# Altium schematic sheet BIT(Built in Test).SchDoc
size 297 x 209 mm; SheetNumber: 8; SheetTotal: 29
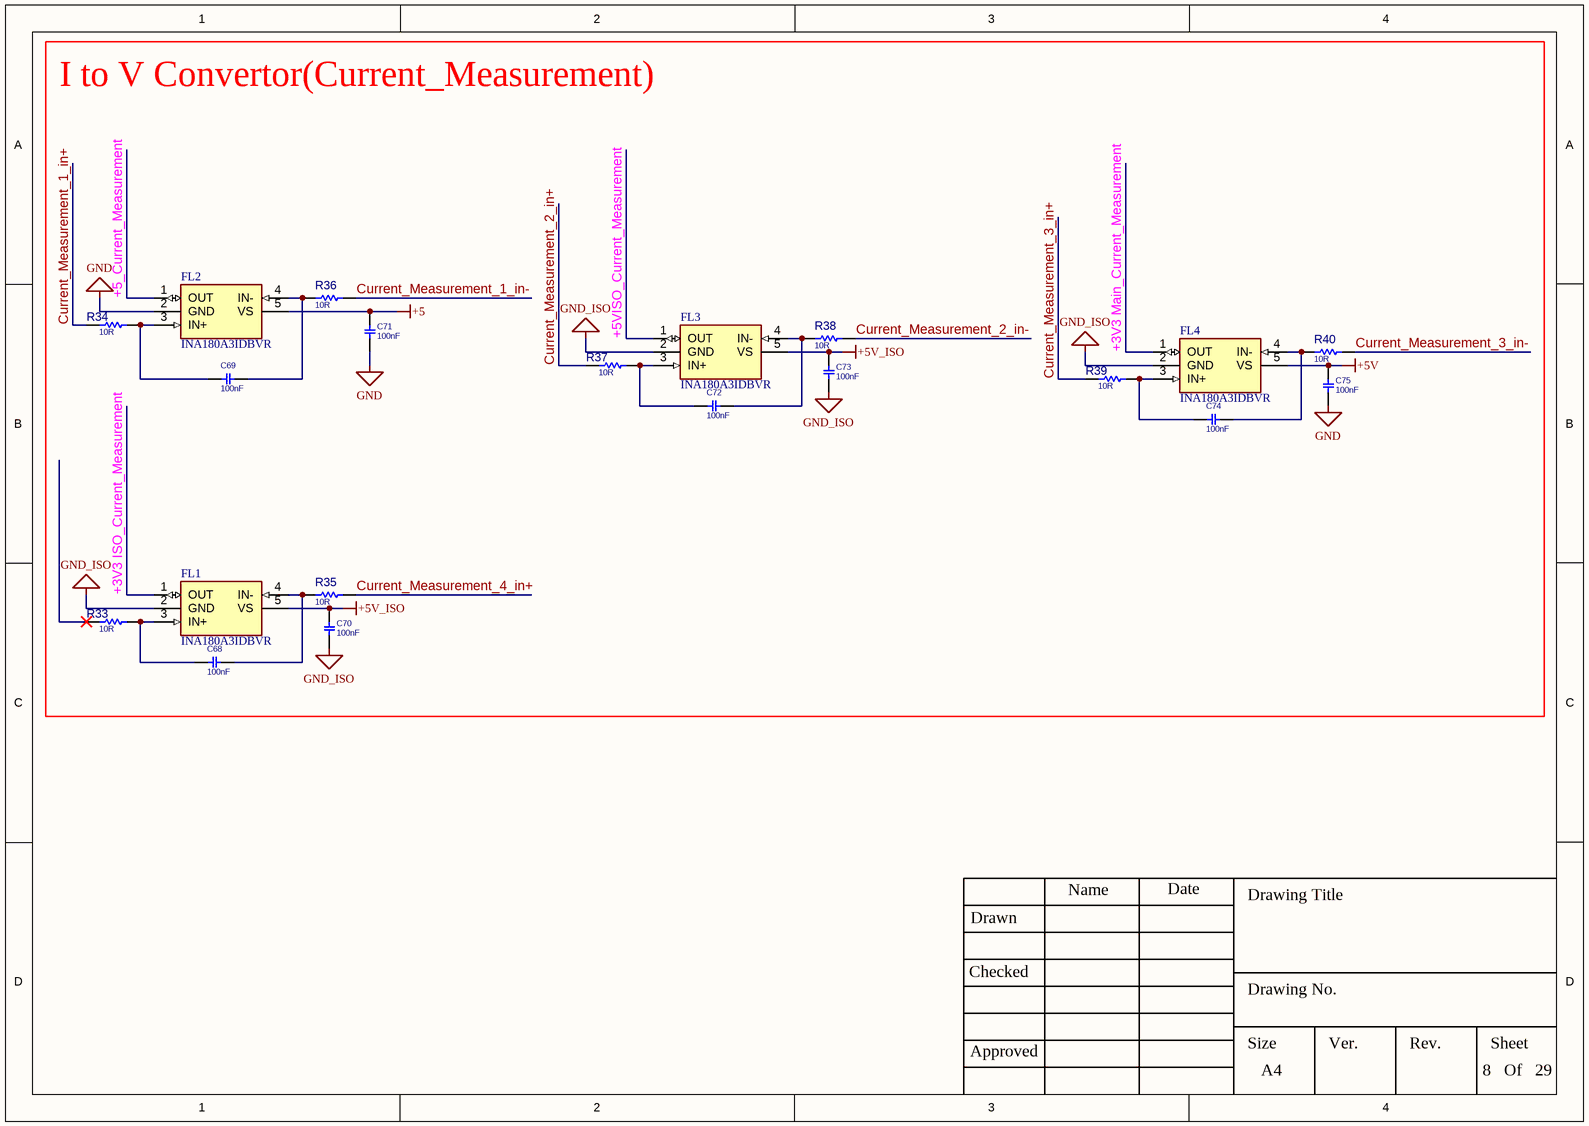
[diagram p0: BIT(Built in Test).SchDoc]

## Parts
C68  100nF  [C0603]
C69  100nF  [C0603]
C70  100nF  [C0603]
C71  100nF  [C0603]
C72  100nF  [C0603]
C73  100nF  [C0603]
C74  100nF  [C0603]
C75  100nF  [C0603]
FL1  INA180A3IDBVR  [SOT95P280X145-5N]
FL2  INA180A3IDBVR  [SOT95P280X145-5N]
FL3  INA180A3IDBVR  [SOT95P280X145-5N]
FL4  INA180A3IDBVR  [SOT95P280X145-5N]
R33  10R  [R2512]
R34  10R  [R2512]
R35  10R  [R2512]
R36  10R  [R2512]
R37  10R  [R2512]
R38  10R  [R2512]
R39  10R  [R2512]
R40  10R  [R2512]

## Blocks framed on the sheet
I to V Convertor(Current_Measurement): C68-C75 FL1-FL4 R33-R40

## Nets
+5: C71.2 FL2.5(VS)
+5V: C75.2 FL4.5(VS)
+5V_ISO: C70.2 C73.2 FL1.5(VS) FL3.5(VS)
GND: C71.1 C75.1 FL2.2(GND)
GND_ISO: C70.1 C73.1 FL1.2(GND) FL3.2(GND) FL4.2(GND)
+3V3 ISO_Current_Measurement: FL1.1(OUT)
+3V3 Main_Current_Measurement: FL4.1(OUT)
+5_Current_Measurement: FL2.1(OUT)
+5VISO_Current_Measurement: FL3.1(OUT)
Current_Measurement_1_in+: R34.1
Current_Measurement_1_in-: R36.2
Current_Measurement_2_in+: R37.1
Current_Measurement_2_in-: R38.2
Current_Measurement_3_in+: R39.1
Current_Measurement_3_in-: R40.2
Current_Measurement_4_in+: R35.2
NetC68_1: C68.1 FL1.4(IN-) R35.1
NetC68_2: C68.2 FL1.3(IN+) R33.2
NetC69_1: C69.1 FL2.4(IN-) R36.1
NetC69_2: C69.2 FL2.3(IN+) R34.2
NetC72_1: C72.1 FL3.4(IN-) R38.1
NetC72_2: C72.2 FL3.3(IN+) R37.2
NetC74_1: C74.1 FL4.4(IN-) R40.1
NetC74_2: C74.2 FL4.3(IN+) R39.2

Not connected (* = marked no-connect by the designer): R33 1*

## Notes on the sheet
- Drawn
- Name
- Date
- Drawing Title
- Checked
- Drawing No.
- Approved
- Size
- A4
- Ver.
- Rev.
- Sheet
- Of

## Library data of the parts
C68-C75 = CAP_SMD_MLCC_10u25V_0603: CAP, MLCC; MANF_P#: GRM188R61E106KA73; MANF: Murata; PARAM: X5R, 10%; PARAM2: 25V; PRICE: 100=15$; VALUE: 100nF
FL1-FL4 = INA180A3IDBVR: Filter; Manufacturer_Name: Texas Instruments; Datasheet Link: http://www.ti.com/lit/gpn/INA180; Height: 1.45mm; Manufacturer_Part_Number: INA180A3IDBVR; Mouser Part Number: 595-INA180A3IDBVR; Mouser Price/Stock: https://www.mouser.co.uk/ProductDetail/Texas-Instruments/INA180A3IDBVR?qs=5aG0NVq1C4xT61h4EgbaIA%3D%3D; Arrow Part Number: INA180A3IDBVR; Arrow Price/Stock: https://www.arrow.com/en/products/ina180a3idbvr/texas-instruments?region=nac
R33-R40 = RES_SMD_2512: RESISTOR, SMD; PARAM: -W; DESC: DESCRIPTION; DIST#: MOUSER; PARAM2: 1%; MANF_P#: -; MANF: -; ASSEMBLY: ASSEMBLY; PRICE: 100= 0.5$; VALUE: 10R